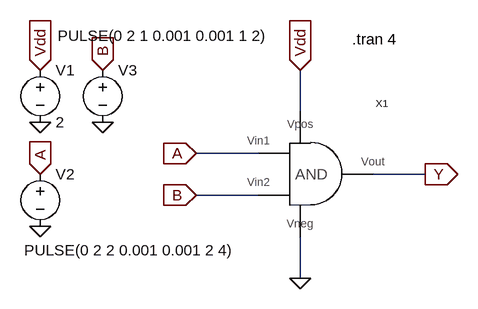
[diagram p0: schematic AND_TESTING.asc]
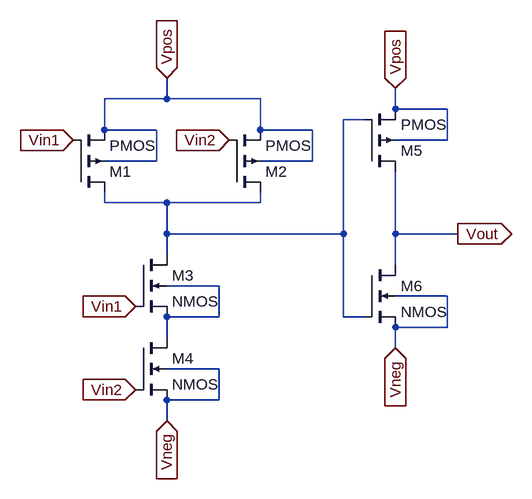
[diagram p1: sub-circuit and_sym.asc]
AND_TESTING.asc, the LTspice schematic file:
Version 4
SHEET 1 880 680
WIRE 144 0 144 -64
WIRE 80 64 -16 64
WIRE 336 96 256 96
WIRE 80 128 -16 128
WIRE 144 256 144 192
FLAG 144 256 0
FLAG -256 -64 Vdd
IOPIN -256 -64 In
FLAG -256 96 A
IOPIN -256 96 In
FLAG -160 -64 B
IOPIN -160 -64 In
FLAG -16 64 A
IOPIN -16 64 In
FLAG -16 128 B
IOPIN -16 128 In
FLAG 144 -64 Vdd
IOPIN 144 -64 In
FLAG -256 16 0
FLAG -256 176 0
FLAG -160 16 0
FLAG 336 96 Y
IOPIN 336 96 Out
SYMBOL AND_SYM 160 96 R0
SYMATTR InstName X1
SYMBOL voltage -256 -80 R0
WINDOW 123 0 0 Left 0
WINDOW 39 0 0 Left 0
SYMATTR InstName V1
SYMATTR Value 2
SYMBOL voltage -256 80 R0
WINDOW 3 -25 133 Left 2
WINDOW 123 0 0 Left 0
WINDOW 39 0 0 Left 0
SYMATTR Value PULSE(0 2 2 0.001 0.001 2 4)
SYMATTR InstName V2
SYMBOL voltage -160 -80 R0
WINDOW 3 -69 -37 Left 2
WINDOW 123 0 0 Left 0
WINDOW 39 0 0 Left 0
SYMATTR Value PULSE(0 2 1 0.001 0.001 1 2)
SYMATTR InstName V3
TEXT 224 -112 Left 2 !.tran 4

and_sym.asc, the sub-circuit schematic file:
Version 4
SHEET 1 880 680
WIRE 272 -16 272 -48
WIRE 272 -16 176 -16
WIRE 416 -16 272 -16
WIRE 624 0 624 -32
WIRE 704 0 624 0
WIRE 576 16 544 16
WIRE 176 32 176 -16
WIRE 256 32 176 32
WIRE 416 32 416 -16
WIRE 496 32 416 32
WIRE 704 48 704 0
WIRE 704 48 624 48
WIRE 256 80 256 32
WIRE 256 80 176 80
WIRE 496 80 496 32
WIRE 496 80 416 80
WIRE 176 144 176 128
WIRE 272 144 176 144
WIRE 416 144 416 128
WIRE 416 144 272 144
WIRE 272 192 272 144
WIRE 544 192 544 16
WIRE 544 192 272 192
WIRE 624 192 624 96
WIRE 720 192 624 192
WIRE 272 224 272 192
WIRE 624 240 624 192
WIRE 352 272 272 272
WIRE 704 288 624 288
WIRE 352 320 352 272
WIRE 352 320 272 320
WIRE 544 320 544 192
WIRE 576 320 544 320
WIRE 704 336 704 288
WIRE 704 336 624 336
WIRE 272 352 272 320
WIRE 624 368 624 336
WIRE 352 400 272 400
WIRE 352 448 352 400
WIRE 352 448 272 448
WIRE 272 480 272 448
FLAG 272 -48 Vpos
IOPIN 272 -48 In
FLAG 128 48 Vin1
IOPIN 128 48 In
FLAG 224 304 Vin1
IOPIN 224 304 In
FLAG 224 432 Vin2
IOPIN 224 432 In
FLAG 720 192 Vout
IOPIN 720 192 Out
FLAG 368 48 Vin2
IOPIN 368 48 In
FLAG 272 480 Vneg
IOPIN 272 480 In
FLAG 624 -32 Vpos
IOPIN 624 -32 In
FLAG 624 368 Vneg
IOPIN 624 368 In
SYMBOL pmos4 128 128 M180
SYMATTR InstName M1
SYMBOL pmos4 368 128 M180
SYMATTR InstName M2
SYMBOL nmos4 224 224 R0
SYMATTR InstName M3
SYMBOL nmos4 224 352 R0
SYMATTR InstName M4
SYMBOL pmos4 576 96 M180
SYMATTR InstName M5
SYMBOL nmos4 576 240 R0
SYMATTR InstName M6

The netlist it stands for:
* AND_TESTING.asc
XX1 A B Vdd 0 Y and_sym
V1 Vdd 0 2
V2 A 0 PULSE(0 2 2 0.001 0.001 2 4)
V3 B 0 PULSE(0 2 1 0.001 0.001 1 2)

* block symbol definitions
.subckt and_sym Vin1 Vin2 Vpos Vneg Vout
M1 N001 Vin1 Vpos Vpos PMOS
M2 N001 Vin2 Vpos Vpos PMOS
M3 N001 Vin1 N002 N002 NMOS
M4 N002 Vin2 Vneg Vneg NMOS
M5 Vout N001 Vpos Vpos PMOS
M6 Vout N001 Vneg Vneg NMOS
.ends and_sym

.model NMOS NMOS
.model PMOS PMOS
.lib standard.mos
.tran 4
.backanno
.end

* Results of the author's LTspice run, read from the files saved beside the schematic
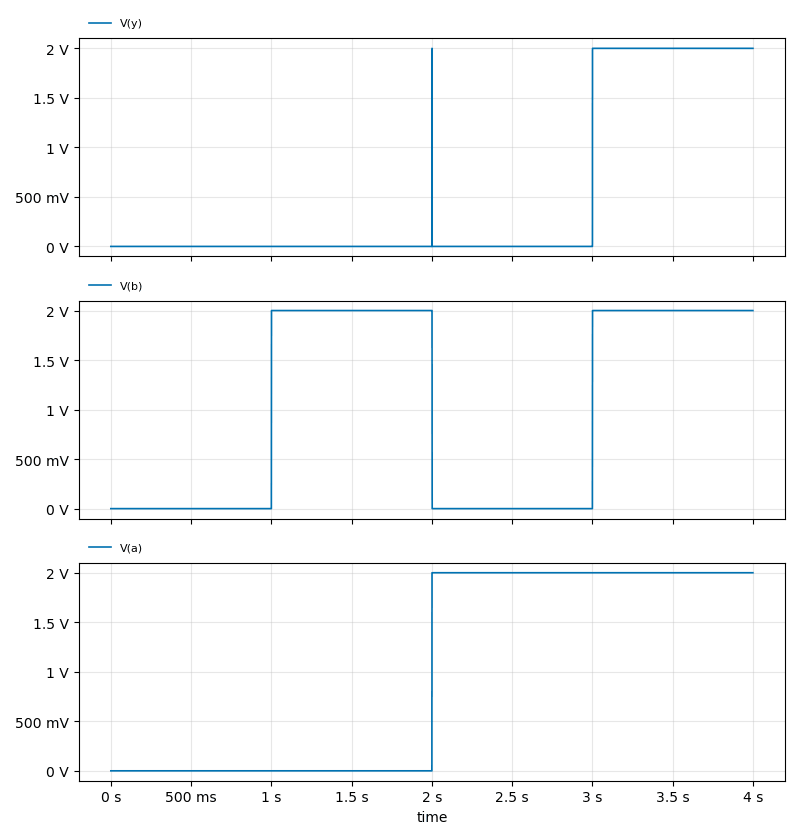
[diagram p2: Transient Analysis of AND_TESTING.asc, plotted from the saved traces]
* Transient Analysis, 1 run:
*   V(y): min 0 V, max 2 V, average 500.1 mV, rms 1 V, last 2 V
*   V(b): min 0 V, max 2 V, average 1 V, rms 1.414 V, last 2 V
*   V(a): min 0 V, max 2 V, average 999.8 mV, rms 1.414 V, last 2 V